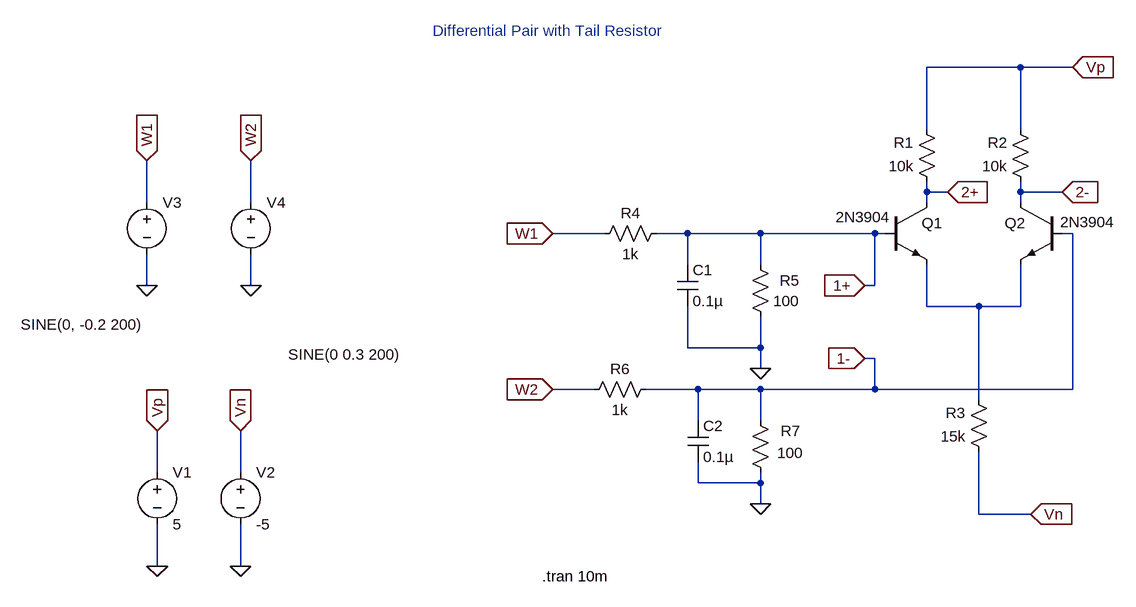
[diagram p0: schematic diff_pair.asc]
diff_pair.asc, the LTspice schematic file:
Version 4
SHEET 1 1032 680
WIRE 864 -208 720 -208
WIRE 944 -208 864 -208
WIRE 720 -112 720 -208
WIRE 864 -112 864 -208
WIRE 720 -16 720 -32
WIRE 752 -16 720 -16
WIRE 864 -16 864 -32
WIRE 928 -16 864 -16
WIRE -480 0 -480 -64
WIRE -320 0 -320 -64
WIRE 720 0 720 -16
WIRE 864 0 864 -16
WIRE 224 48 144 48
WIRE 352 48 304 48
WIRE 464 48 352 48
WIRE 640 48 464 48
WIRE 656 48 640 48
WIRE 944 48 928 48
WIRE 352 96 352 48
WIRE 464 96 464 48
WIRE -480 128 -480 80
WIRE -320 128 -320 80
WIRE 640 128 640 48
WIRE 640 128 624 128
WIRE 720 160 720 96
WIRE 800 160 720 160
WIRE 864 160 864 96
WIRE 864 160 800 160
WIRE 352 224 352 160
WIRE 464 224 464 176
WIRE 464 224 352 224
WIRE 640 240 624 240
WIRE 464 256 464 224
WIRE 208 288 144 288
WIRE 368 288 288 288
WIRE 464 288 368 288
WIRE 640 288 640 240
WIRE 640 288 464 288
WIRE 944 288 944 48
WIRE 944 288 640 288
WIRE 800 304 800 160
WIRE 368 336 368 288
WIRE 464 336 464 288
WIRE -464 416 -464 352
WIRE -336 416 -336 352
WIRE 368 432 368 400
WIRE 464 432 464 416
WIRE 464 432 368 432
WIRE 464 464 464 432
WIRE 800 480 800 384
WIRE 880 480 800 480
WIRE -464 560 -464 496
WIRE -336 560 -336 496
FLAG 464 256 0
FLAG 464 464 0
FLAG 944 -208 Vp
IOPIN 944 -208 In
FLAG 880 480 Vn
IOPIN 880 480 In
FLAG 144 48 W1
IOPIN 144 48 In
FLAG 144 288 W2
IOPIN 144 288 In
FLAG -464 560 0
FLAG -336 560 0
FLAG -480 128 0
FLAG -320 128 0
FLAG -464 352 Vp
IOPIN -464 352 In
FLAG -336 352 Vn
IOPIN -336 352 In
FLAG -480 -64 W1
IOPIN -480 -64 In
FLAG -320 -64 W2
IOPIN -320 -64 In
FLAG 928 -16 2-
IOPIN 928 -16 In
FLAG 752 -16 2+
IOPIN 752 -16 In
FLAG 624 128 1+
IOPIN 624 128 In
FLAG 624 240 1-
IOPIN 624 240 In
SYMBOL res 736 -16 R180
WINDOW 0 36 76 Left 2
WINDOW 3 36 40 Left 2
SYMATTR InstName R1
SYMATTR Value 10k
SYMBOL res 880 -16 R180
WINDOW 0 36 76 Left 2
WINDOW 3 36 40 Left 2
SYMATTR InstName R2
SYMATTR Value 10k
SYMBOL res 816 400 R180
WINDOW 0 36 76 Left 2
WINDOW 3 36 40 Left 2
SYMATTR InstName R3
SYMATTR Value 15k
SYMBOL res 208 64 R270
WINDOW 0 32 56 VTop 2
WINDOW 3 0 56 VBottom 2
SYMATTR InstName R4
SYMATTR Value 1k
SYMBOL res 480 192 R180
WINDOW 0 -44 72 Left 2
WINDOW 3 -44 40 Left 2
SYMATTR InstName R5
SYMATTR Value 100
SYMBOL res 192 304 R270
WINDOW 0 32 56 VTop 2
WINDOW 3 0 56 VBottom 2
SYMATTR InstName R6
SYMATTR Value 1k
SYMBOL res 480 432 R180
WINDOW 0 -46 80 Left 2
WINDOW 3 -50 46 Left 2
SYMATTR InstName R7
SYMATTR Value 100
SYMBOL npn 656 0 R0
WINDOW 3 -76 23 Left 2
SYMATTR Value 2N3904
SYMATTR InstName Q1
SYMBOL npn 928 0 M0
WINDOW 3 -82 30 Left 2
SYMATTR Value 2N3904
SYMATTR InstName Q2
SYMBOL cap 336 96 R0
SYMATTR InstName C1
SYMATTR Value 0.1µ
SYMBOL cap 352 336 R0
SYMATTR InstName C2
SYMATTR Value 0.1µ
SYMBOL voltage -464 400 R0
WINDOW 123 0 0 Left 0
WINDOW 39 0 0 Left 0
SYMATTR InstName V1
SYMATTR Value 5
SYMBOL voltage -336 400 R0
WINDOW 123 0 0 Left 0
WINDOW 39 0 0 Left 0
SYMATTR InstName V2
SYMATTR Value -5
SYMBOL voltage -480 -16 R0
WINDOW 3 391 250 Right 2
WINDOW 123 0 0 Left 0
WINDOW 39 0 0 Left 0
SYMATTR Value SINE(0 0.3 200)
SYMATTR InstName V3
SYMBOL voltage -320 -16 R0
WINDOW 3 -354 204 Left 2
WINDOW 123 0 0 Left 0
WINDOW 39 0 0 Left 0
SYMATTR Value SINE(0, -0.2 200)
SYMATTR InstName V4
TEXT 128 576 Left 2 !.tran 10m
TEXT -40 -264 Left 2 ;Differential Pair with Tail Resistor

The netlist it stands for:
* diff_pair.asc
R1 2+ Vp 10k
R2 2- Vp 10k
R3 Vn N001 15k
R4 W1 1+ 1k
R5 0 1+ 100
R6 W2 1- 1k
R7 0 1- 100
Q1 2+ 1+ N001 0 2N3904
Q2 2- 1- N001 0 2N3904
C1 1+ 0 0.1µ
C2 1- 0 0.1µ
V1 Vp 0 5
V2 Vn 0 -5
V3 W1 0 SINE(0 0.3 200)
V4 W2 0 SINE(0, -0.2 200)
.model NPN NPN
.model PNP PNP
.lib standard.bjt
.tran 10m
* Differential Pair with Tail Resistor
.backanno
.end